# Altium schematic sheet SDCard.SchDoc
size Letter
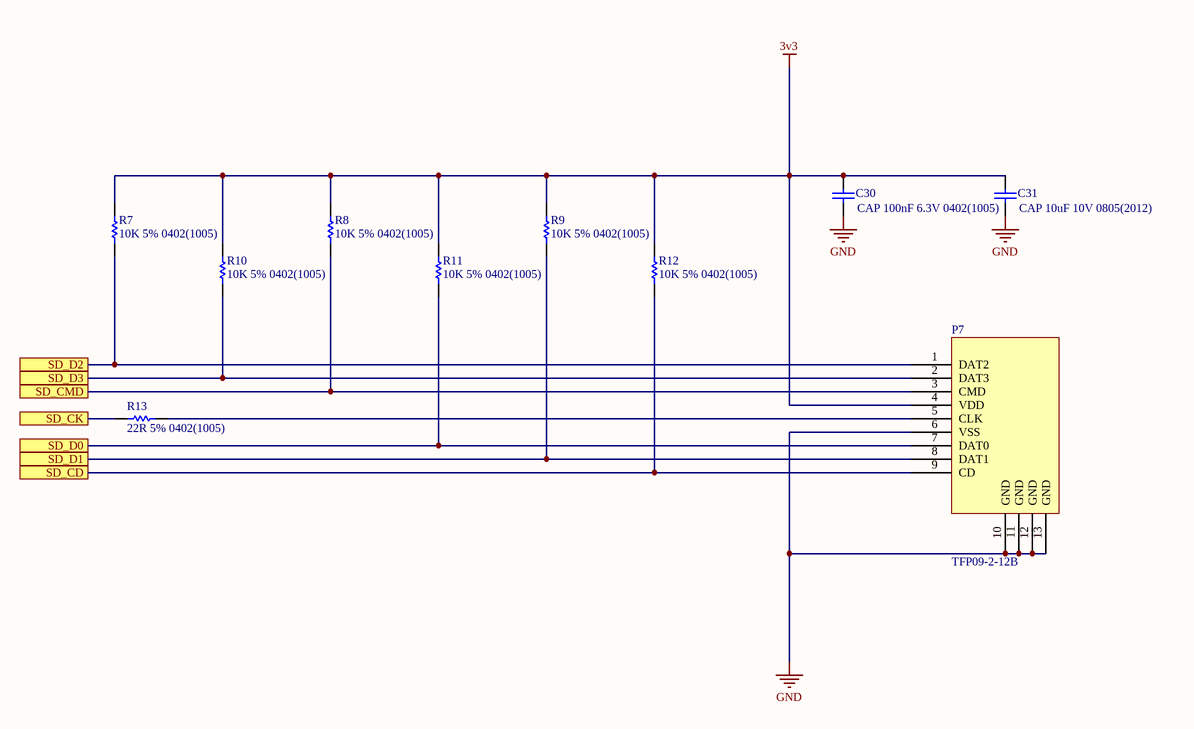
[diagram p0: SDCard.SchDoc]

## Parts
C30  CAP 100nF 6.3V 0402(1005)  [CAPC0402(1005)60_M]
C31  CAP 10uF 10V 0805(2012)  [CAPC0805(2012)100_N]
P7  TFP09-2-12B  [TFP09-2-12B]
R7  10K 5% 0402(1005)  [RESC0402(1005)_N]
R8  10K 5% 0402(1005)  [RESC0402(1005)_N]
R9  10K 5% 0402(1005)  [RESC0402(1005)_N]
R10  10K 5% 0402(1005)  [RESC0402(1005)_N]
R11  10K 5% 0402(1005)  [RESC0402(1005)_N]
R12  10K 5% 0402(1005)  [RESC0402(1005)_N]
R13  22R 5% 0402(1005)  [RESC0402(1005)_M]

## Ports
SD_CD, SD_CK, SD_CMD, SD_D0, SD_D1, SD_D2, SD_D3

## Nets
3v3: C30.2 C31.2 P7.4(VDD) R7.2 R8.2 R9.2 R10.2 R11.2 R12.2
GND: C30.1 C31.1 P7.6(VSS) P7.10(GND) P7.11(GND) P7.12(GND) P7.13(GND)
SD_CD: P7.9(CD) R12.1 ; port SD_CD
SD_CK: R13.1 ; port SD_CK
SD_CMD: P7.3(CMD) R8.1 ; port SD_CMD
SD_D0: P7.7(DAT0) R11.1 ; port SD_D0
SD_D1: P7.8(DAT1) R9.1 ; port SD_D1
SD_D2: P7.1(DAT2) R7.1 ; port SD_D2
SD_D3: P7.2(DAT3) R10.1 ; port SD_D3
NetP7_5: P7.5(CLK) R13.2

## Notes on the sheet
- Title
- Size:
- Date:
- Letter
- Number:
- Time:
- Revision:
- Sheet
- of
- Copyright 2019
- Specialized Solutions LLC
- 206 W Lincoln Hwy STE B
- New Haven, IN 46774
- www.specsolns.com <http://www.specsolns.com>
- File:

## Library data of the parts
C30 = CMP-1034-02062-1: CAP 100nF 6.3V ±20% 0402 (1005 Metric) Thickness 0.6mm SMD; Case-EIA: 0402; Tolerance: Â±20%; Case-Metric: 1005; Value: 100nF; Technology: SMT; Max Thickness: 0.6 mm; Rated Voltage: 6.3 V
C31 = CMP-1036-04925-1: CAP 10uF 10V ±20% 0805 (2012 Metric) Thickness 1mm SMD; Case-Metric: 2012; Case-EIA: 0805; Tolerance: Â±20%; Technology: SMT; Max Thickness: 1 mm; Rated Voltage: 10 V; Value: 10uF
P7 = TFP09-2-12B: MicroSD Card Slot
R7-R12 = CMP-1011-00098-1: 10K 0.063W 5% 0402 (1005 Metric)  SMD; Case-Metric: 1005; Value: 10000.00 Ohm; Case-EIA: 0402; Technology: SMT; Tolerance: 5 %; Power: 0.063 W
R13 = CMP-1011-00034-1: 22R 0.063W 5% 0402 (1005 Metric)  SMD; Value: 22.00 Ohm; Case-EIA: 0402; Case-Metric: 1005; Power: 0.063 W; Tolerance: 5 %; Technology: SMT